# Altium schematic sheet [07] - SD.SchDoc
size A4
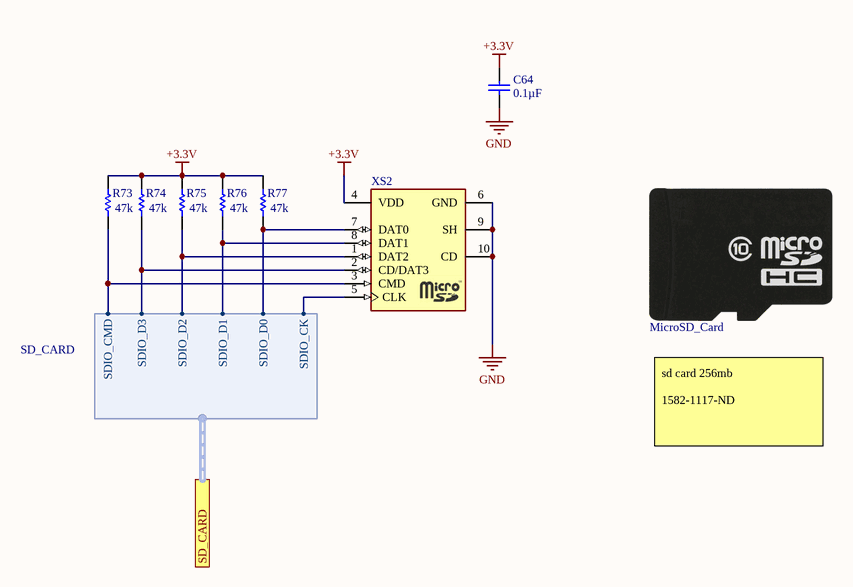
[diagram p0: [07] - SD.SchDoc]

## Parts
*1  MicroSD_Card  (mechanical)
C64  Capacitance: 0.1µF  [0603_C]  (hidden comment: Capacitor)
R73  Resistance: 47k  [0603_R]  (hidden comment: Res1)
R74  Resistance: 47k  [0603_R]  (hidden comment: Res1)
R75  Resistance: 47k  [0603_R]  (hidden comment: Res1)
R76  Resistance: 47k  [0603_R]  (hidden comment: Res1)
R77  Resistance: 47k  [0603_R]  (hidden comment: Res1)
XS2  (no value)  [MICROSD]

## Ports
SD_CARD (harness SD_CARD)

## Harnesses
SD_CARD: SDIO_CMD, SDIO_D0, SDIO_D1, SDIO_D2, SDIO_D3, SDIO_CK

## Nets
+3.3V: C64.2 R73.2 R74.2 R75.2 R76.2 R77.2 XS2.4(VDD)
GND: C64.1 XS2.6(GND) XS2.9(SH) XS2.10(CD)
NetR73_1: R73.1 XS2.3(CMD) ; port SD_CARD.SDIO_CMD
NetR74_1: R74.1 XS2.2(CD/DAT3) ; port SD_CARD.SDIO_D3
NetR75_1: R75.1 XS2.1(DAT2) ; port SD_CARD.SDIO_D2
NetR76_1: R76.1 XS2.8(DAT1) ; port SD_CARD.SDIO_D1
NetR77_1: R77.1 XS2.7(DAT0) ; port SD_CARD.SDIO_D0
NetXS2_5: XS2.5(CLK) ; port SD_CARD.SDIO_CK

## Notes on the sheet
- sd card 256mb
  1582-1117-ND
- Title
- Size:
- Date:
- A4
- Number:
- Time:
- Revision:
- Sheet
- of
- File:

## Library data of the parts
*1 = MicroSD_Card: Manufacturer: Apacer; Manufacturer Part Number: AP-MSD256ISI-1T; Supplier 1: Digi-Key; Supplier Part Number 1: 1582-1117-ND; Stock 1: 4143; Pricing 1: 1=12.85, 10=11.903, 25=11.6336, 50=11.5698, 100=10.1856, 250=9.68168, 500=9.5823, 1000=9.26289 (USD); ComponentLink1URL: http://www.mouser.com/ds/2/24/EDM_mSD(SLC)-957981.pdf; ComponentLink1Description: http://www.mouser.com/ds/2/24/EDM_mSD(SLC)-957981.pdf; ComponentLink2URL: http://eflash.apacerus.com/spec/Card/microSD/Consumer/EDM_mSD(SLC).pdf; ComponentLink2Description: http://eflash.apacerus.com/spec/Card/microSD/Consumer/EDM_mSD(SLC).pdf
C64 = 1: Chip Capacitor Nonpolar; Manufacturer: Kemet; Manufacturer Part Number: C0603C104K5RACTU; Tolerance: ±10%; Voltage - Rated: 50V; Temperature Coefficient: X7R; Supplier 1: Digi-Key; Supplier Part Number 1: 399-5089-1-ND; RoHS: RoHS Compliant; Category: Capacitors; Stock 1: 3992655; Pricing 1: 1=0.1, 10=0.041, 50=0.0222, 100=0.0187, 250=0.01532, 500=0.0131, 1000=0.0102 (USD); Packaging: Cut Tape (CT); Mounting Type: Surface Mount, MLCC; Operating Temperature: -55°C ~ 125°C; Applications: General Purpose; Ratings: -; Package / Case: 0603 (1608 Metric); Size / Dimension: 0.063" L x 0.031" W (1.60mm x 0.80mm); Height - Seated (Max): -; Thickness (Max): 0.034" (0.87mm); Lead Spacing: -; Features: -; Lead Style: -; ComponentLink1URL: http://www.kemet.com/docfinder?Partnumber=C0603C104K5RACTU; ComponentLink1Description: http://www.kemet.com/docfinder?Partnumber=C0603C104K5RACTU
R73-R77 = 1: Chip Resistor; Manufacturer: Panasonic; Manufacturer Part Number: ERJ-3EKF4702V; Tolerance: 1%; Power Rating: 100mW; Voltage Rating: 75V; Temperature Coefficient: 100ppm/°C; Working Voltage: 6V; Supplier 1: Digi-Key; Supplier Part Number 1: P47.0KHDKR-ND; Stock 1: 2918345; Pricing 1: 1=0.1, 10=0.079, 100=0.0323, 1000=0.01449, 2500=0.01258 (USD); Mount: Surface Mount; Case/Package: 0603; Number of Pins: 2; Case Code (Metric): 1608; Case Code (Imperial): 0603; Contact Plating: Tin; Min Operating Temperature: -55°C; Max Operating Temperature: 155°C; Packaging: Tape and Reel; Package Quantity: 1; Composition: Thick Film; Number of Terminations: 2; Termination: SMD/SMT; Military Standard: Not; Max Power Dissipation: 100mW; Voltage Rating (DC): 75V; Features: Automotive AEC-Q200; Length: 1.6mm; Height: 0.022inch; Width: 0.031inch; Depth: 0.8mm; Radiation Hardening: No; REACH SVHC: No SVHC; Lead Free: Lead Free; ComponentLink1URL: https://datasheet.ciiva.com/6138/aoa0000ce2-6138149.pdf; ComponentLink1Description: https://datasheet.ciiva.com/6138/aoa0000ce2-6138149.pdf; ComponentLink2URL: https://datasheet.ciiva.com/48531/aoa0000ce2-48531029.pdf; ComponentLink2Description: https://datasheet.ciiva.com/48531/aoa0000ce2-48531029.pdf; ComponentLink3URL: https://datasheet.ciiva.com/7802/aoa0000ce2-7802421.pdf; ComponentLink3Description: https://datasheet.ciiva.com/7802/aoa0000ce2-7802421.pdf; ComponentLink4URL: https://datasheet.ciiva.com/16514/aoa0000ce2-16514071.pdf; ComponentLink4Description: https://datasheet.ciiva.com/16514/aoa0000ce2-16514071.pdf; ComponentLink5URL: https://datasheet.ciiva.com/46398/1678782-46398088.pdf; ComponentLink5Description: https://datasheet.ciiva.com/46398/1678782-46398088.pdf; ComponentLink6URL: https://datasheet.ciiva.com/24069/aoa0000ce2-24069209.pdf; ComponentLink6Description: https://datasheet.ciiva.com/24069/aoa0000ce2-24069209.pdf; ComponentLink7URL: https://datasheet.ciiva.com/46398/1678782-46398089.pdf; ComponentLink7Description: https://datasheet.ciiva.com/46398/1678782-46398089.pdf; ComponentLink8URL: https://datasheet.ciiva.com/30236/aoa0000ce2-30236698.pdf; ComponentLink8Description: https://datasheet.ciiva.com/30236/aoa0000ce2-30236698.pdf; ComponentLink9URL: https://datasheet.ciiva.com/22722/426256-22722781.pdf; ComponentLink9Description: https://datasheet.ciiva.com/22722/426256-22722781.pdf; ComponentLink10URL: https://datasheet.ciiva.com/7802/1678782-7802686.pdf; ComponentLink10Description: https://datasheet.ciiva.com/7802/1678782-7802686.pdf; ComponentLink11URL: https://datasheet.ciiva.com/16758/70260748-16758831.pdf; ComponentLink11Description: https://datasheet.ciiva.com/16758/70260748-16758831.pdf
XS2 = MICROSD: =Description; Manufacturer: Molex; Manufacturer Part Number: 105162-0001; Connector Type: Connector; Max Voltage Rating (DC): 5V; Number of Contacts: 8; Pitch: 1.09mm; Supplier 1: Digi-Key; Supplier Part Number 1: WM14405DKR-ND; Stock 1: 9741; Pricing 1: 1=0.88, 10=0.774, 100=0.6677, 500=0.54628, 1000=0.48558 (USD); Mount: Surface Mount; Contact Material: Bronze; Contact Plating: Gold; Housing Material: Thermoplastic; Min Operating Temperature: -40°C; Max Operating Temperature: 85°C; Packaging: Tape and Reel; Number of Rows: 1; Package Quantity: 6000; Termination: Solder; Orientation: Right Angle; Number of Circuits: 8; Length: 11.3mm; Depth: 7.6mm; Radiation Hardening: No; ComponentLink1URL: https://datasheet.ciiva.com/29723/1051620101-sd-29723393.pdf; ComponentLink1Description: https://datasheet.ciiva.com/29723/1051620101-sd-29723393.pdf